# Altium schematic sheet SWD_TagConnect.SchDoc: Tag-Connect SWD Port
size A4; DocumentNumber: 5; SheetNumber: 5; SheetTotal: 8
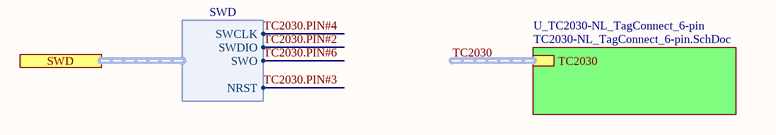
[diagram p0: SWD_TagConnect.SchDoc]

## Sub-sheets
U_TC2030-NL_TagConnect_6-pin = TC2030-NL_TagConnect_6-pin.SchDoc: TC2030 (harness TC2030)

## Ports
SWD (harness SWD)

## Harnesses
SWD: SWDIO, SWCLK, NRST, SWO

## Nets
TC2030.PIN#2: port SWD.SWDIO
TC2030.PIN#3: port SWD.NRST
TC2030.PIN#4: port SWD.SWCLK
TC2030.PIN#6: port SWD.SWO

## Buses and harness runs
harness TC2030 = sheet U_TC2030-NL_TagConnect_6-pin/TC2030

## Notes on the sheet
- Title:
- Number:
- Size:
- Date:
- A4
- Time:
- Revision:
- Sheet
- File:
- of